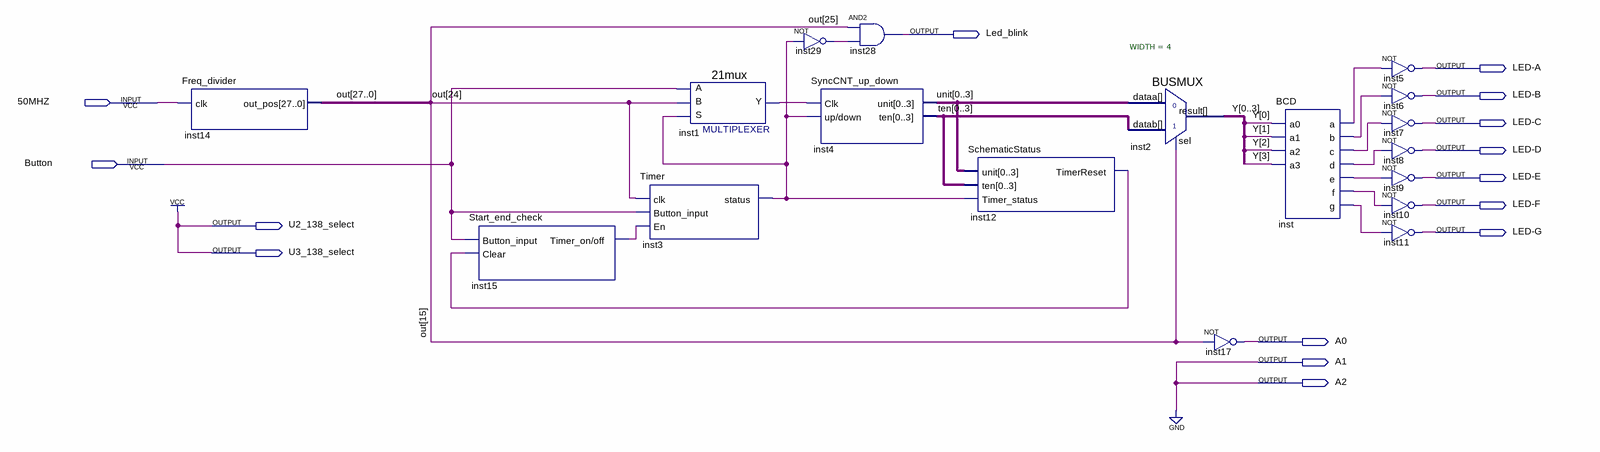
[diagram p0: schematic sheet]
// Quartus schematic main.bdf as structural Verilog: 18 symbols, 15 pins
module main (
  input  \50MHZ ,
  input  Button,
  output Led_blink,
  output \LED-A ,
  output \LED-B ,
  output \LED-C ,
  output \LED-D ,
  output \LED-E ,
  output \LED-F ,
  output U2_138_select,
  output \LED-G ,
  output U3_138_select,
  output A0,
  output A1,
  output A2
);

  wire inst1_y, inst3_status, inst12_timerreset, inst15_timer_on_off, inst29_out, inst_a, inst_b, inst_c,
       inst_d, inst_e, inst_f, inst_g;
  wire [3:0] ten, unit, Y;
  wire [27:0] out;

  Freq_divider inst14 (.clk(\50MHZ ), .out_pos(out));
  Start_end_check inst15 (.Button_input(Button), .Clear(inst12_timerreset), .\Timer_on/off (inst15_timer_on_off));
  Timer inst3 (.clk(out[24]), .Button_input(Button), .En(inst15_timer_on_off), .status(inst3_status));
  \21mux  inst1 (.S(inst3_status), .B(out[24]), .A(Button), .Y(inst1_y));
  not inst29 (inst29_out, inst3_status);
  SyncCNT_up_down inst4 (
    .Clk(inst1_y), .\up/down (inst3_status), .unit({unit[0], unit[1], unit[2], unit[3]}),
    .ten({ten[0], ten[1], ten[2], ten[3]}));
  and inst28 (Led_blink, out[25], inst29_out);
  SchematicStatus inst12 (
    .unit({unit[0], unit[1], unit[2], unit[3]}), .ten({ten[0], ten[1], ten[2], ten[3]}),
    .Timer_status(inst3_status), .TimerReset(inst12_timerreset));
  BUSMUX #(.WIDTH(4)) inst2 (
    .datab({ten[0], ten[1], ten[2], ten[3]}), .sel(out[15]), .dataa({unit[0], unit[1], unit[2], unit[3]}),
    .result({Y[0], Y[1], Y[2], Y[3]}));
  not inst17 (A0, out[15]);
  BCD inst (
    .a0(Y[0]), .a1(Y[1]), .a2(Y[2]), .a3(Y[3]), .a(inst_a), .b(inst_b), .c(inst_c), .d(inst_d), .e(inst_e),
    .f(inst_f), .g(inst_g));
  not inst5 (\LED-A , inst_a);
  not inst6 (\LED-B , inst_b);
  not inst7 (\LED-C , inst_c);
  not inst8 (\LED-D , inst_d);
  not inst9 (\LED-E , inst_e);
  not inst10 (\LED-F , inst_f);
  not inst11 (\LED-G , inst_g);

  assign A1 = 1'b0;
  assign A2 = 1'b0;
  assign U2_138_select = 1'b1;
  assign U3_138_select = 1'b1;
endmodule
